# Altium schematic sheet PSUv2.SchDoc
size Legal; SheetNumber: 1; SheetTotal: 1; SPICEModelCacheSHAHFHRU: <root> / <DocumentId>SHAHFHRU</DocumentId> / </root>
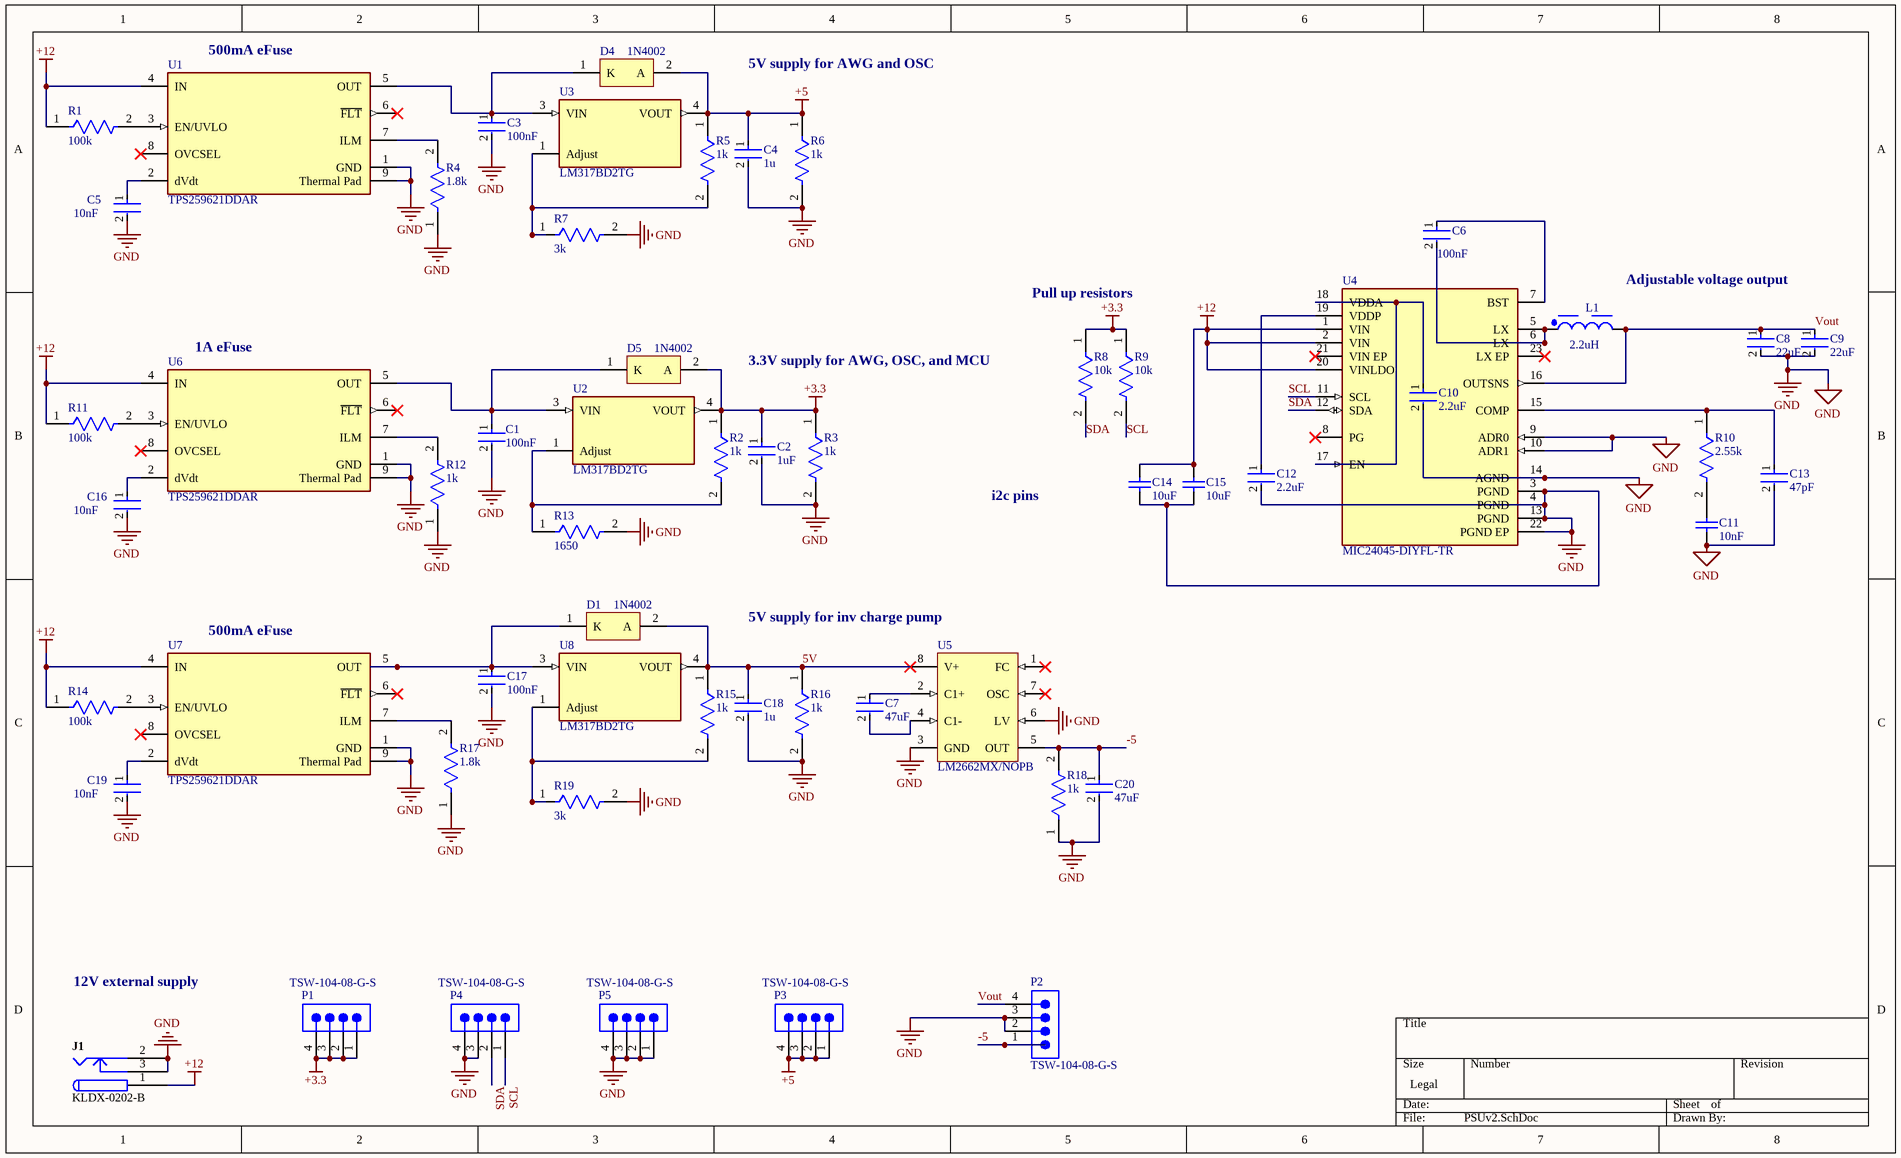
[diagram p0: PSUv2.SchDoc]

## Parts
C1  100nF  [FP-CC0805-0_85-MFG]
C2  1uF  [FP-CC0805-0_85-MFG]
C3  100nF  [FP-CC0805-0_85-MFG]
C4  1u  [FP-CC0805-0_85-MFG]
C5  10nF  [FP-CC0805-0_85-MFG]
C6  100nF  [FP-CC0805-0_85-MFG]
C7  47uF  [FP-GRM21B-0_2-e0_2_0_7-IPC_A]
C8  22uF  [FP-C0805C226M8PACTU-MFG]
C9  22uF  [FP-C0805C226M8PACTU-MFG]
C10  2.2uF  [FP-CC0805-0_85-MFG]
C11  10nF  [CAPC2013X94X50LL20T25]
C12  2.2uF  [FP-CC0805-0_85-MFG]
C13  47pF  [FP-C0805C-DN-MFG]
C14  10uF  [CAPC2013X140X50ML20T25]
C15  10uF  [CAPC2013X140X50ML20T25]
C16  10nF  [FP-CC0805-0_85-MFG]
C17  100nF  [FP-CC0805-0_85-MFG]
C18  1u  [FP-CC0805-0_85-MFG]
C19  10nF  [FP-CC0805-0_85-MFG]
C20  47uF  [FP-GRM21B-0_2-e0_2_0_7-IPC_A]
D1  1N4002  [ONSC-AXIAL_LEAD-2-59-10_P]
D4  1N4002  [ONSC-AXIAL_LEAD-2-59-10_P]
D5  1N4002  [ONSC-AXIAL_LEAD-2-59-10_P]
J1  KLDX-0202-B  [KYCN-KLDX-0202-B_V]
L1  2.2uH  [WE-LQS_6045]
P1  TSW-104-08-G-S  [SMTC-TSW-104-08-X-S]
P2  TSW-104-08-G-S  [SMTC-TSW-104-08-X-S]
P3  TSW-104-08-G-S  [SMTC-TSW-104-08-X-S]
P4  TSW-104-08-G-S  [SMTC-TSW-104-08-X-S]
P5  TSW-104-08-G-S  [SMTC-TSW-104-08-X-S]
R1  100k  [FP-RMCF0805-MFG]
R2  1k  [FP-RMCF0805-MFG]
R3  1k  [FP-RMCF0805-MFG]
R4  1.8k  [FP-AC0805-MFG]
R5  1k  [FP-RMCF0805-MFG]
R6  1k  [FP-RMCF0805-MFG]
R7  3k  [FP-RMCF0805-IPC_B]
R8  10k  [FP-PATT0805-MFG]
R9  10k  [FP-PATT0805-MFG]
R10  2.55k  [FP-RMCF0805-IPC_B]
R11  100k  [FP-RMCF0805-MFG]
R12  1k  [FP-AC0805-MFG]
R13  1650  [FP-RT0805-MFG]
R14  100k  [FP-RMCF0805-MFG]
R15  1k  [FP-RMCF0805-MFG]
R16  1k  [FP-RMCF0805-MFG]
R17  1.8k  [FP-AC0805-MFG]
R18  1k  [FP-RMCF0805-MFG]
R19  3k  [FP-RMCF0805-IPC_B]
U1  TPS259621DDAR  [FP-DDA0008J-IPC_A]
U2  LM317BD2TG  [FP-936-03-MFG]
U3  LM317BD2TG  [FP-936-03-MFG]
U4  MIC24045-DIYFL-TR  [FP-FQFN33-20LD-PL-1-MFG]
U5  LM2662MX/NOPB  [D0008A_M]
U6  TPS259621DDAR  [FP-DDA0008J-IPC_A]
U7  TPS259621DDAR  [FP-DDA0008J-IPC_A]
U8  LM317BD2TG  [FP-936-03-MFG]

## Nets
+3.3: C2.1 D5.2(A) P1.1 P1.2 P1.3 P1.4 R2.1 R3.1 R8.1 R9.1 U2.4(VOUT)
+5: C4.1 D4.2(A) P3.1 P3.2 P3.3 P3.4 R5.1 R6.1 U3.4(VOUT)
+12: C14.2 C15.2 J1.1 R1.1 R11.1 R14.1 U1.4(IN) U4.1(VIN) U4.2(VIN) U4.20(VINLDO) U6.4(IN) U7.4(IN)
GND: C1.2 C2.2 C3.2 C4.2 C5.2 C8.2 C9.2 C10.2 C11.2 C12.2 C13.2 C14.1 C15.1 C16.2 C17.2 C18.2 C19.2 C20.2 J1.2 J1.3 P2.2 P2.3 P4.3 P4.4 P5.1 P5.2 P5.3 P5.4 R3.2 R4.1 R6.2 R7.2 R12.1 R13.2 R16.2 R17.1 R18.1 R19.2 U1.1(GND) U1.9(Thermal_Pad) U4.3(PGND) U4.4(PGND) U4.9(ADR0) U4.10(ADR1) U4.13(PGND) U4.14(AGND) U4.22(PGND_EP) U5.3(GND) U5.6(LV) U6.1(GND) U6.9(Thermal_Pad) U7.1(GND) U7.9(Thermal_Pad)
5V: C18.1 D1.2(A) R15.1 R16.1 U5.8(V+) U8.4(VOUT)
-5: C20.1 P2.1 R18.2 U5.5(OUT)
SCL: P4.1 R9.2 U4.11(SCL)
SDA: P4.2 R8.2 U4.12(SDA)
Vout: C8.1 C9.1 L1.2 P2.4 U4.16(OUTSNS)
NetC1_1: C1.1 D5.1(K) U2.3(VIN) U6.5(OUT)
NetC3_1: C3.1 D4.1(K) U1.5(OUT) U3.3(VIN)
NetC5_1: C5.1 U1.2(dVdt)
NetC6_1: C6.1 U4.7(BST)
NetC6_2: C6.2 L1.1 U4.5(LX) U4.6(LX)
NetC7_1: C7.1 U5.2(C1+)
NetC7_2: C7.2 U5.4(C1-)
NetC10_1: C10.1 U4.17(EN) U4.18(VDDA)
NetC11_1: C11.1 R10.2
NetC12_1: C12.1 U4.19(VDDP)
NetC13_1: C13.1 R10.1 U4.15(COMP)
NetC16_1: C16.1 U6.2(dVdt)
NetC17_1: C17.1 D1.1(K) U7.5(OUT) U8.3(VIN)
NetC19_1: C19.1 U7.2(dVdt)
NetR1_2: R1.2 U1.3(EN/UVLO)
NetR2_2: R2.2 R13.1 U2.1(Adjust)
NetR4_2: R4.2 U1.7(ILM)
NetR5_2: R5.2 R7.1 U3.1(Adjust)
NetR11_2: R11.2 U6.3(EN/UVLO)
NetR12_2: R12.2 U6.7(ILM)
NetR14_2: R14.2 U7.3(EN/UVLO)
NetR15_2: R15.2 R19.1 U8.1(Adjust)
NetR17_2: R17.2 U7.7(ILM)

Not connected (* = marked no-connect by the designer): U1 6(~{FLT})* 8(OVCSEL)*; U4 8(PG)* 21(VIN_EP)* 23(LX_EP)*; U5 1(FC)* 7(OSC)*; U6 6(~{FLT})* 8(OVCSEL)*; U7 6(~{FLT})* 8(OVCSEL)*

## Notes on the sheet
- (near U1) 500mA eFuse
- 5V supply for AWG and OSC
- Pull up resistors
- Adjustable voltage output
- (near U6) 1A eFuse
- 3.3V supply for AWG, OSC, and MCU
- i2c pins
- (near U7) 500mA eFuse
- (near U5) 5V supply for inv charge pump
- 12V external supply

## Library data of the parts
C1 C3 C6 C17 = CMP-03422-000691-1: CAP CER 0.1UF 25V X7R 0805; Manufacturer: Yageo; Manufacturer Part Number: CC0805MRX7R8BB104; Tolerance: 0.2; Material: Ceramic; Voltage Rating: 25 V; Ipc Land Pattern Name: CAPC200125X85; Automotive: No; Package: CC0805-0.85; Device Class L3: Ceramic Capacitors; Temperature Characteristic: X7R; Temperature Range High: +85°C; Temperature: -30°C to +85°C; Octopart: https://octopart.com/cc0805mrx7r8bb104-yageo-25629596; ComponentLink2URL: http://www.yageo.com/documents/recent/UPY-GPHC_Y5V_6.3V-to-50V_8.pdf; Height: 0.95mm; Capacitance: 100 nF; Mouser Description: Multilayer Ceramic Capacitors MLCC - SMD/SMT 100nF 25V X7R 20%; Device Class L1: Passive Components; Category: Cap; Device Class L2: Capacitors; RoHS: TRUE; Digikey Description: CAP CER 0.1UF 25V X7R 0805; Temperature Range Low: -30°C; Value: 100 nF; ComponentLink2Description: Datasheet; Footprint Url: http://www.yageo.com/exep/pages/download/literatures/UPY-C_GEN_24.pdf; Lead Free: Yes
C2 C4 C18 = CMP-03422-000816-1: CAP CER 1UF 6.3V X5R 0805; Manufacturer: Yageo; Manufacturer Part Number: CC0805KKX5R5BB105; Material: Ceramic; Tolerance: 0.1; Device Class L1: Passive Components; Temperature Characteristic: X5R; Voltage Rating: 6.3 V; Footprint Url: http://www.yageo.com/exep/pages/download/literatures/UPY-C_GEN_24.pdf; Value: 1 uF; Package: CC0805-0.85; Temperature Range High: +85°C; Height: 0.95mm; Temperature Range Low: -30°C; Lead Free: Yes; RoHS: TRUE; Octopart: https://octopart.com/cc0805kkx5r5bb105-yageo-71334571; Capacitance: 1 uF; Ipc Land Pattern Name: CAPC200125X85; Category: Cap; Digikey Description: CAP CER 1UF 6.3V X5R 0805; ComponentLink2URL: http://www.yageo.com/documents/recent/UPY-GPHC_Y5V_6.3V-to-50V_8.pdf; Automotive: No; Device Class L2: Capacitors; ComponentLink2Description: Datasheet; Device Class L3: Ceramic Capacitors; Temperature: -30°C to +85°C
C5 C16 C19 = CMP-03422-000691-1: CAP CER 0.1UF 25V X7R 0805; Manufacturer: Yageo; Manufacturer Part Number: CC0805MRX7R8BB104; Tolerance: 0.2; Capacitance: 100 nF; Material: Ceramic; Value: 100 nF; Voltage Rating: 25 V; Ipc Land Pattern Name: CAPC200125X85; Automotive: No; Package: CC0805-0.85; Device Class L3: Ceramic Capacitors; Temperature Characteristic: X7R; Temperature Range High: +85°C; Temperature: -30°C to +85°C; Octopart: https://octopart.com/cc0805mrx7r8bb104-yageo-25629596; ComponentLink2URL: http://www.yageo.com/documents/recent/UPY-GPHC_Y5V_6.3V-to-50V_8.pdf; Height: 0.95mm; Mouser Description: Multilayer Ceramic Capacitors MLCC - SMD/SMT 100nF 25V X7R 20%; Device Class L1: Passive Components; Category: Cap; Device Class L2: Capacitors; RoHS: TRUE; Digikey Description: CAP CER 0.1UF 25V X7R 0805; Temperature Range Low: -30°C; ComponentLink2Description: Datasheet; Footprint Url: http://www.yageo.com/exep/pages/download/literatures/UPY-C_GEN_24.pdf; Lead Free: Yes
C7 C20 = CMP-2000-06341-2: Chip Multilayer Ceramic Capacitors for General Purpose, 0805, 47uF, X5R, 15%, 20%, 10V; Dissipation Factor: 0.035%; Length: 2mm; Voltage Rating: 10V; Mount: Surface Mount; Width: 0.049inch; Voltage Rating (DC): 10V; Lead Free: Lead Free; REACH SVHC: No SVHC; Termination: SMD/SMT; Case/Package: 0805; Dielectric: X5R; Capacitance: 47uF; Packaging: Tape and Reel; Max Operating Temperature: 85°C; Tolerance: 20%; Thickness: 0.057inch; Dielectric Material: Ceramic; Min Operating Temperature: -55°C; Height: 1.25mm; Case Code (Imperial): 0805; Case Code (Metric): 2012; Depth: 1.25mm; Voltage: 10V
C8 C9 = CMP-03020-034697-1: CAP CER 22UF 10V X5R 0805; Tolerance: 20%; Dissipation Factor: 10%; Dielectric Material: Ceramic; Termination: Solder; Case Code (Imperial): 0805; Packaging: Tape and Reel; Height: 1.25mm; Voltage: 10V; Case Code (Metric): 2012; Case/Package: 0805; Width: 0.049inch; Capacitance: 22uF; Length: 0.079inch; Depth: 1.25mm; RoHS Compliant: Yes; Voltage Rating (DC): 10V; Lead Free: Lead Free; Dielectric: X5R; Thickness: 0.055inch; Mount: Surface Mount; Voltage Rating: 10V; Max Operating Temperature: 85°C; Min Operating Temperature: -55°C
C10 C12 = CMP-03422-001024-1: CAP CER 2.2UF 10V X5R 0805; Manufacturer Part Number: CC0805MKX5R6BB225; Manufacturer: Yageo; Description: CC0805 2.2 uF X5R 20.00% 10 V; Material: Ceramic; Tolerance: 0.2; Mouser Description: Surface Mount Ceramic Multilayer Capacitor 2.2uF 20% X5R 10V 0805 Blister T/R; Device Class L3: Ceramic Capacitors; Lead Free: Yes; Temperature Range Low: -30°C; Height: 0.95mm; Temperature Range High: +85°C; Voltage Rating: 10 V; Temperature Characteristic: X5R; Device Class L2: Capacitors; RoHS: TRUE; Value: 2.2 uF; Package: CC0805-0.85; Footprint Url: http://www.yageo.com/exep/pages/download/literatures/UPY-C_GEN_24.pdf; Category: Cap; Ipc Land Pattern Name: CAPC200125X85; Octopart: https://octopart.com/cc0805mkx5r6bb225-yageo-19022641; Temperature: -30°C to +85°C; ComponentLink2URL: http://www.yageo.com/documents/recent/UPY-GPHC_Y5V_6.3V-to-50V_8.pdf; Device Class L1: Passive Components; Capacitance: 2.2 uF; Automotive: No; Digikey Description: CAP CER 2.2UF 10V X5R 0805; ComponentLink2Description: Datasheet
C11 = CMP-2007-04234-1: Manufacturer: AVX Interconnect / Elco; Part Number: 08053C103JAT2A
C13 = CMP-03020-029200-1: C0805 47 pF X7R 30ppm/°C 10.00% 50 V; Manufacturer: KEMET; Manufacturer Part Number: C0805C470K5RACTU; Material: Ceramic; Voltage Rating: 50 V; Tolerance: 0.1; Height: 0.88mm; RoHS: TRUE; Automotive: No; Category: Cap; Temperature Range Low: -55°C; Ipc Land Pattern Name: CAPC200125X78; Temperature Range High: +125°C; Device Class L1: Passive Components; Capacitance: 47 pF; Temperature: -55°C to +125°C; Octopart: https://octopart.com/c0805c470k5ractu-kemet-89187434; Device Class L3: Ceramic Capacitors; ComponentLink2Description: Datasheet; Device Class L2: Capacitors; Temperature Coefficient: 30ppm/°C; Lead Free: Yes; Value: 47 pF; ComponentLink2URL: https://content.kemet.com/datasheets/KEM_C1003_C0G_SMD.pdf; Temperature Characteristic: X7R; Package: C0805C-DN; Mouser Description: Cap, 47Pf, 50V, 10%, X7R, 0805
C14 C15 = CMP-2007-04644-1: Part Number: 08056D106KAT4A; Manufacturer: AVX Interconnect / Elco
D1 D4 D5 = CMP-0902-00207-1: Standard Recovery Rectifier, 2-Pin Axial_Lead, Pb-Free, Bulk Bag; Manufacturer: On Semiconductor; IO(rec) Max (A): 1; IFSM Max (A): 30; VRRM Max (V): 100; ComponentLink3Description: Package Specification; ComponentLink1Description: Manufacturer URL; Type: Standard Recovery; PackageVersion: Rev. U, 02/2005; Mounting Technology: Through Hole; ComponentLink1URL: http://www.onsemi.com/; ComponentLink3URL: http://www.onsemi.cn/pub_link/Collateral/59-10.PDF; ComponentLink2URL: http://www.onsemi.com/pub_link/Collateral/1N4001-D.PDF; Packing: Bulk Bag; PackageDescription: 2-Pin, Axial Lead, Diameter 2.35 mm; ComponentLink2Description: Datasheet; PartNumber: 1N4002; DatasheetVersion: Rev. 13; PackageReference: AXIAL_LEAD-2-59-10; RoHS: TRUE
J1 = CMP-0256-00001-1: 3 Conductor Power Jack, 2 break 2 aux contacts; ComponentLink2URL: http://anacapa.kycon.com/Catalog_PDF/KLDX_0202.pdf; PackageReference: KLDX-0202-B; Contact Finish: Brass; ComponentLink2Description: Datasheet; Mounting Technology: Through Hole; PackageDescription: Jack, 9 x 14.5 mm Body, 2.5 mm Center Pin Diameter; ComponentLink1Description: Manufacturer URL; PartNumber: KLDX-0202-B; ComponentLink1URL: http://kycon.com/
L1 = CMP-03913-46948291-2: Inductor Power Semi-Shielded Wirewound 2.2uH 30% 100KHz 4.6A 14mOhm DCR 2424 T/R; Current Rating: 5.4A; Core Material: Ferrite; Inductance: 2.2µH; DC Resistance (DCR): 14mΩ; Saturation Current: 7.4A; Self Resonant Frequency: 60MHz; Shielding: Shielded; Max DC Current: 4.6A; Composition: Wirewound; Min Operating Temperature: -40°C; Height - Seated (Max): 4.4958mm; Tolerance: 30%; REACH SVHC: Unknown; Width: 6mm; Mount: Surface Mount; Case/Package: Nonstandard; Max Operating Temperature: 125°C; Inductance Tolerance: 30%; Ambient Temperature Range High: 85°C; Test Frequency: 100kHz; Length: 6mm; Height: 4.5mm; RMS Current (Irms): 4.6A; RoHS: Compliant; Termination: SMD/SMT; Ambient Temperature Range Low: -40°C
P1-P5 = CMP-1024-00357-1: 0.025" SQ Post Header, Through-hole, Vertical, -55 to 125 degC, 2.54 mm Pitch, 4-Pin, Male, RoHS; Manufacturer: Samtec; Pitch: 2.54 mm; RoHS: True; ComponentLink3URL: http://www.samtec.com/documents/webfiles/cpdf/TSW-XXX-XX-XXX-X-XX-XXX-MKT.pdf; Mounting Technology: Through-hole; ComponentLink2URL: http://www.samtec.com/documents/webfiles/pdf/TSW_TH.PDF; ComponentLink1URL: http://www.samtec.com; ComponentLink3Description: Package Specification; PackageVersion: DM, 8/1988; ComponentLink2Description: Datasheet; PackageReference: TSW-104-08-X-S; PackageDescription: .025[0.64] SQ. Post Terminal Strip Assembly; PartNumber: TSW-104-08-G-S; ComponentLink1Description: Manufacturer URL; Temperature Range: -55 to 125 degC; DatasheetVersion: F-214; Orientation: Vertical
R1-R3 R5 R6 R11 R14-R16 R18 = CMP-26527-002945-1: 1kΩ ±1% 0.125W 0805 Thick Film Chip Resistor AEC-Q200 compliant; Resistance: 1kR; Max Power Dissipation: 125mW; Temperature Coefficient: 100ppm/°C; Series: RMCF; Packaging: Tape and Reel; Depth: 1.25mm; Tolerance: 1%; Contact Plating: Tin; Height: 0.026inch; Length: 2mm; Resistor Type: Thick Film; Lead Free: Lead Free; Width: 0.049inch; Military Standard: Not; RoHS Compliant: Yes; Case/Package: 0805; Min Operating Temperature: -55°C; Mount: Surface Mount; Max Operating Temperature: 155°C; Construction: Rectangular; Features: Automotive AEC-Q200; Number of Terminations: 2; Radiation Hardening: No
R4 R12 R17 = CMP-03412-037599-1: RES SMD 1.8K OHM 1% 1/8W 0805; Manufacturer: Yageo; Manufacturer Part Number: AC0805FR-071K8L; Value: 1.8KΩ; Automotive Grade: Grade 0; Voltage Rating: 150V; Tolerance: 0.01; Digikey Description: RES SMD 1.8K OHM 1% 1/8W 0805; Lead Free: Yes; Automotive: Yes; Temperature Range Low: -55°C; Device Class L2: Resistors; Device Class L3: Chip SMD Resistors; Footprint Url: http://www.yageo.com/exep/pages/download/literatures/PYu-R_Mount_10.pdf; Package: AC0805; Temperature: -55°C to +155°C; Power Rating: 1/8W; RoHS: TRUE; Temperature Range High: +155°C; Height: 0.6mm; Composition: Thick Film; Series: AC; Ipc Land Pattern Name: RESC200125X50; ComponentLink2URL: http://www.yageo.com/documents/recent/PYu-AC_51_RoHS_L_6.pdf; Octopart: https://octopart.com/ac0805fr-071k8l-yageo-30510907; Resistance: 1.8KΩ; Device Class L1: Passive Components; Category: Res; ComponentLink2Description: Datasheet; Mouser Description: Thick Film Resistors - SMD 1/8W 1.8K ohm 1% AEC-Q200
R7 R19 = CMP-26527-001434-1: 3kΩ ±5% 0.125W 0805 Thick Film Chip Resistor AEC-Q200 compliant; Resistance: 3kR; Max Power Dissipation: 125mW; Temperature Coefficient: 200ppm/°C; Length: 0.079inch; Package Quantity: 10000; Tolerance: 5%; Radiation Hardening: No; Features: Automotive AEC-Q200; Number of Terminations: 2; Height: 0.026inch; Series: RMCF; Contact Plating: Tin; Max Operating Temperature: 155°C; Width: 0.049inch; Case/Package: 0805; Min Operating Temperature: -55°C; Packaging: Tape and Reel; Case Code (Metric): 2012; Mount: Surface Mount; Resistor Type: Thick Film; Case Code (Imperial): 0805
R8 R9 = CMP-02407-000039-1: RES SMD 10K OHM 0.1% 1/5W 0805; Manufacturer Part Number: PATT0805E1002BGT1; Manufacturer: Vishay; Resistance: 10kΩ; Value: 10kΩ; Automotive Grade: Grade 0; Description: 10 kOhms ±0.1% 0.2W, 1/5W Chip Resistor 0805 (2012 Metric) Anti-Sulfur, Automotive AEC-Q200, Moisture Resistant Thin Film; Temperature Coefficient: 25ppm/°C; Power Rating: 200mW; Voltage Rating: 100V; Category: Res; RoHS: TRUE; Tolerance: 0.1%; Digikey Description: RES SMD 10K OHM 0.1% 1/5W 0805; Height: 0.018inch; Automotive: Yes; Package: PATT0805; Octopart: https://octopart.com/patt0805e1002bgt1-vishay-34963131; Device Class L3: Chip SMD Resistors; Temperature Range High: +250°C; Series: PATT; Temperature: -55°C to +250°C; ComponentLink2URL: http://www.vishay.com/docs/60124/patt.pdf; Ipc Land Pattern Name: RESC203127X38; Composition: Thin Film; Device Class L2: Resistors; Temperature Range Low: -55°C; Lead Free: Yes; ComponentLink2Description: Datasheet; Footprint Url: http://www.vishay.com/docs/60119/landpatterns.pdf; Device Class L1: Passive Components
R10 = CMP-26527-005431-1: 2.55kΩ ±1% 0.125W 0805 Thick Film Chip Resistor AEC-Q200 compliant; Resistance: 2.55kR; Temperature Coefficient: 100ppm/°C; Max Power Dissipation: 125mW; Width: 0.049inch; RoHS Compliant: Yes; Features: Automotive AEC-Q200; Contact Plating: Tin; Case/Package: 0805; Mount: Surface Mount; Height: 0.026inch; Tolerance: 1%; Min Operating Temperature: -55°C; Packaging: Tape and Reel; Series: RMCF; Length: 0.079inch; Max Operating Temperature: 155°C; Radiation Hardening: No; Resistor Type: Thick Film; Number of Terminations: 2
R13 = CMP-03412-005070-1: RES SMD 1.65K OHM 1% 1/8W 0805; Manufacturer: Yageo; Manufacturer Part Number: RT0805FRE071K65L; Power Rating: 0.125W; Tolerance: 0.0001; Resistance: 1.65KΩ; Temperature Coefficient: 50 ppm/°C; Voltage Rating: 150V; Value: 1.65KΩ; ComponentLink2URL: http://www.yageo.com/documents/recent/PYu-RT_1-to-0.01_RoHS_L_9.pdf; Height: 0.6mm; Temperature Range High: +155°C; Device Class L3: Chip SMD Resistors; Octopart: https://octopart.com/rt0805fre071k65l-yageo-1226722; ComponentLink2Description: Datasheet; Digikey Description: RES SMD 1.65K OHM 1% 1/8W 0805; Mouser Description: Thin Film Resistors - SMD 1/8W 1.65K ohm 1% 50ppm; Temperature: -55°C to +155°C; RoHS: TRUE; Temperature Range Low: -55°C; Composition: Thin Film; Footprint Url: http://www.yageo.com/exep/pages/download/literatures/PYu-R_Mount_10.pdf; Package: RT0805; Ipc Land Pattern Name: RESC200125X50; Series: RT; Category: Res; Lead Free: Yes; Device Class L2: Resistors; Device Class L1: Passive Components; Automotive: No
U1 U6 U7 = CMP-04910-000076-1: 2.7-19V 130MA-2A SURGE CLAMPING
U2 U3 U8 = CMP-07128-000010-1: IC REG LINEAR POS ADJ 1.5A D2PAK; Manufacturer: ON Semiconductor; Max Junction Temp: +125°C; Number Of Outputs: 1; Max Supply Voltage: 40V; Standoff Height: 0mm; Output Voltage: 1.2-37V; Output Type: AdjustableProgrammable; Mouser Description: Linear Voltage Regulators 1.5A ADJ 1.2-37V Positive; RoHS: TRUE; Footprint Url: https://www.onsemi.com/pub/Collateral/936-03.PDF; Lead Free: Yes; Height: 4.826mm; ComponentLink2Description: Datasheet; Package: 936-03; Digikey Description: IC REG LINEAR POS ADJ 1.5A D2PAK; Automotive: No; Device Class L1: Integrated Circuits (ICs); Category: IC; Output Current: 1.5A; Device Class L2: Power Management ICs; Manufacturer Part Number: LM317BD2TG; Temperature Range Low: -40°C; Temperature: -40°C to +125°C; Device Class L3: Voltage Regulators - Linear; ComponentLink2URL: https://www.onsemi.com/pub/Collateral/LM317-D.PDF; Temperature Range High: +125°C; Octopart: https://octopart.com/lm317bd2tg-on+semiconductor-1010532
U4 = CMP-06325-000069-1: IC REG BUCK PROG 5A 20FQFN; Switching Frequency: 780kHz; Min Input Voltage: 4.5V; Synchronous Rectifier: Yes; Max Input Voltage: 19V; Number of Outputs: 1; Min Output Voltage: 1V; Output Configuration: Positive; Number of Pins: 20; Max Operating Temperature: 125°C; Series: -; Packaging: Cut Tape; RoHS Compliant: Yes; Output Current: 5A; Min Operating Temperature: -40°C; Mount: Surface Mount
U5 = CMP-0065-00025-3: Switched Capacitor Voltage Converter, 8-pin Narrow SOIC, Pb-Free; Manufacturer: Texas Instruments; PowerWise: N; CompType: Switch Caps; PackageTopMarking: NSZXTT*LM26*62M; PackageReference: D0008A; PinCount: 8; RoHS: Y; ComponentLink1URL: http://www.ti.com/general/docs/lit/getliterature.tsp?genericPartNumber=LM2662&fileType=pdf; Code_IPC: SOIC127P600-8; ComponentLink1Description: Datasheet URL; PackageDescription: SOIC Narrow, 4.9 x 3.9 x 1.45mm, 8 Lead, 1.27mm Pitch; Code_JEDEC: MS-012-AA